# EAGLE design DB_DA7_schematic (EAGLE 9.3.2)
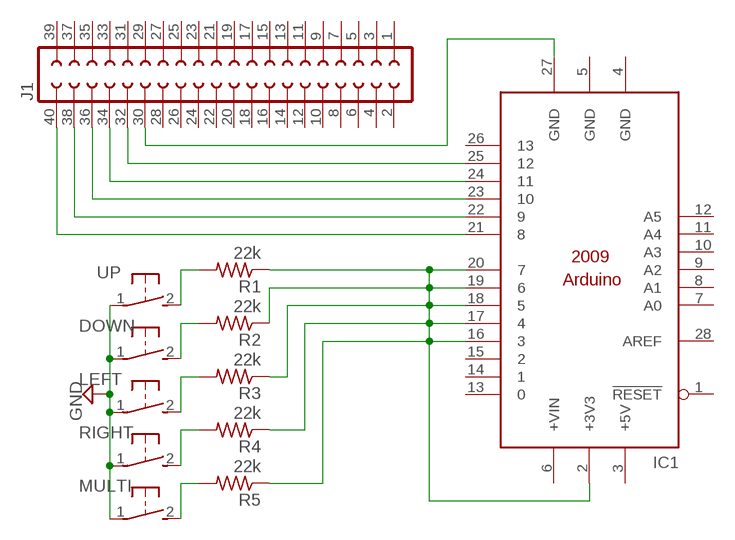
[diagram p0: schematic, sheet 1]

## Parts
DOWN  31-XX  [B3F-31XX]
IC1  ARDUINO2009_10  [ARDUINO2009]
J1  SOCKET-40V  [S40V]
LEFT  31-XX  [B3F-31XX]
MULTI  31-XX  [B3F-31XX]
R1  22k  R-US_0204/7  [0204/7]
R2  22k  R-US_0204/7  [0204/7]
R3  22k  R-US_0204/7  [0204/7]
R4  22k  R-US_0204/7  [0204/7]
R5  22k  R-US_0204/7  [0204/7]
RIGHT  31-XX  [B3F-31XX]
UP  31-XX  [B3F-31XX]

## Nets
GND: DOWN.1(P) LEFT.1(P) MULTI.1(P) RIGHT.1(P) UP.1(P)
N$1: IC1.21 J1.40
N$2: IC1.22 J1.38
N$3: IC1.23 J1.36
N$4: IC1.24 J1.34
N$5: IC1.25 J1.32
N$6: IC1.27(GND) J1.30
N$7: R1.2 UP.2(S)
N$8: DOWN.2(S) R2.2
N$9: LEFT.2(S) R3.2
N$10: R4.2 RIGHT.2(S)
N$11: MULTI.2(S) R5.2
N$16: IC1.2(+3V3) IC1.16 IC1.17 IC1.18 IC1.19 IC1.20 R1.1 R2.1 R3.1 R4.1 R5.1
Unconnected: IC1.1(!RESET) IC1.6(+VIN) IC1.7(A0) IC1.8(A1) IC1.9(A2) IC1.10(A3) IC1.11(A4) IC1.12(A5) IC1.13 IC1.14 IC1.15 IC1.26 IC1.28(AREF) J1.1 J1.2 J1.3 J1.4 J1.5 J1.6 J1.7 J1.8 J1.9 J1.10 J1.11 J1.12 J1.13 J1.14 J1.15 J1.16 J1.17 J1.18 J1.19 J1.20 J1.21 J1.22 J1.23 J1.24 J1.25 J1.26 J1.27 J1.28 J1.29 J1.31 J1.33 J1.35 J1.37 J1.39

## Power pins joined to a net without a drawn wire
+5V: IC1.3(+5V)
GND: IC1.4(GND) IC1.5(GND)

## Library data of the parts
DOWN LEFT MULTI RIGHT UP = switch-omron:31-XX: OMRON SWITCH; MPN: B3F-3100; OC_FARNELL: 959704; OC_NEWARK: 36M3582
IC1 = arduino:ARDUINO2009_1: The Arduino Duemilanove ("2009") is a microcontroller board based on the ATmega168 or ATmega328. - 14 digital input/output pins (of which 6 can be used as PWM outputs) - 6 analog inputs, a 16 MHz crystal oscillator - USB connection - power jack - ISP header - reset button It contains everything needed to support the microcontroller; simply connect it to a computer with a USB cable or power it with a AC-to-DC adapter or battery to get started http://arduino.cc/en/Main/ArduinoBoardDuemilanove
J1 = con-3m-skt-header:SOCKET-40: 40 pin PCB Socket (3m 85xx/51xx)
R1-R5 = rcl:R-US_: RESISTOR, American symbol; SPICEPREFIX: R

## Board
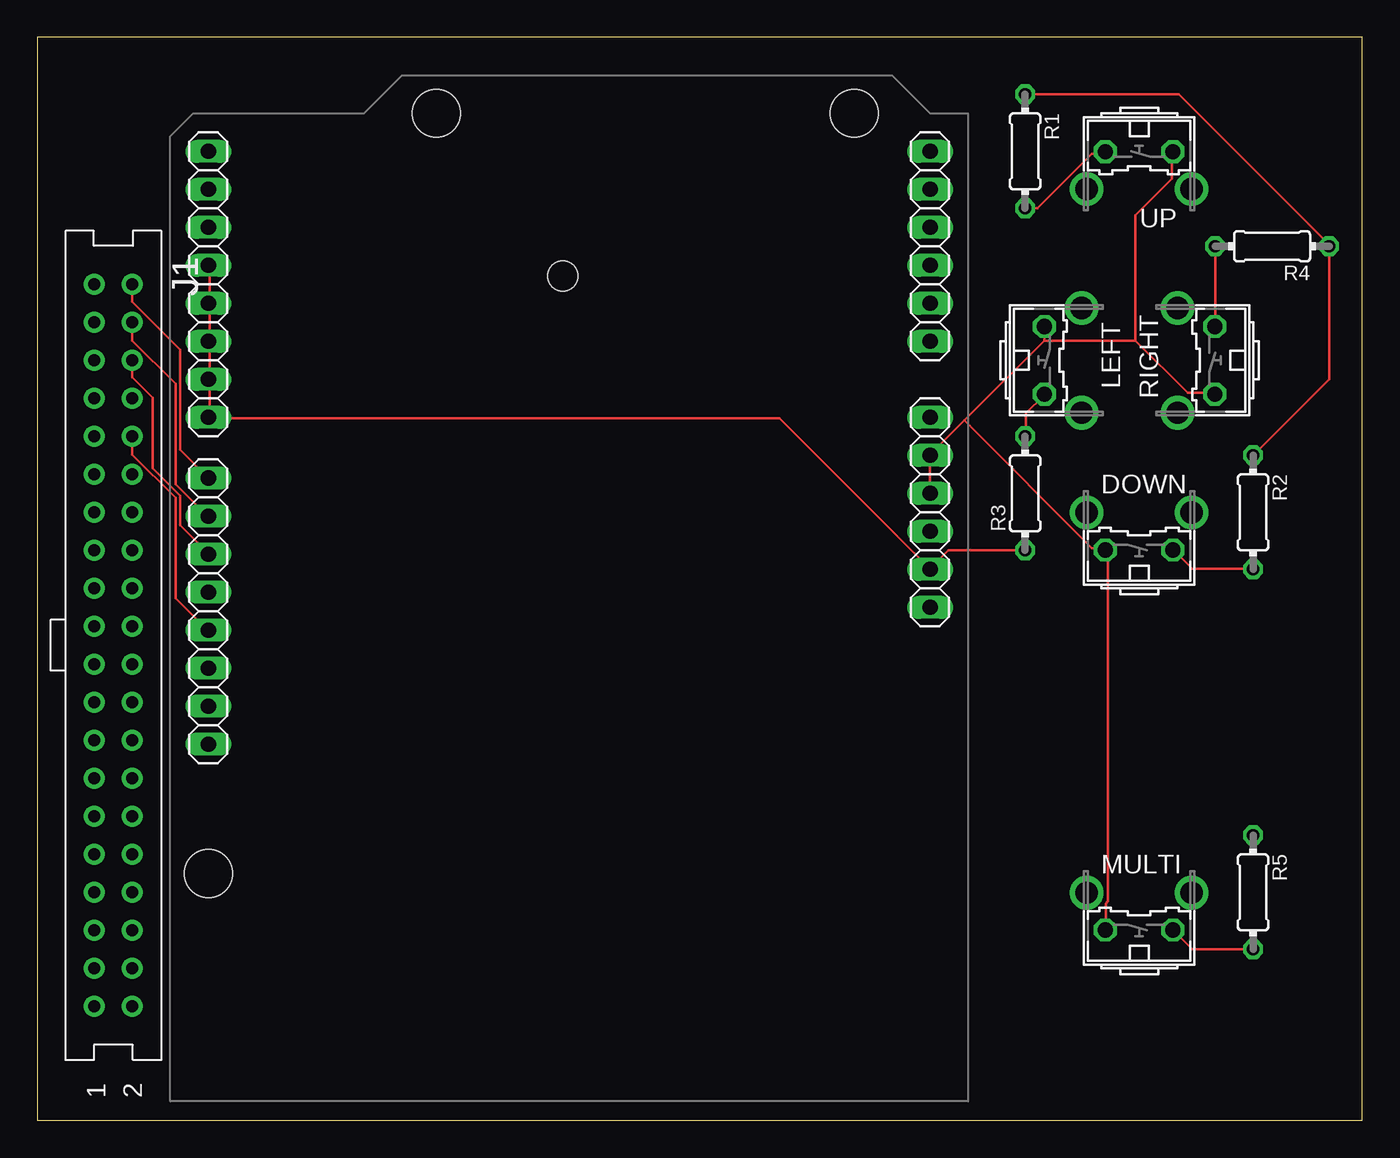
[diagram p1: board, top side]
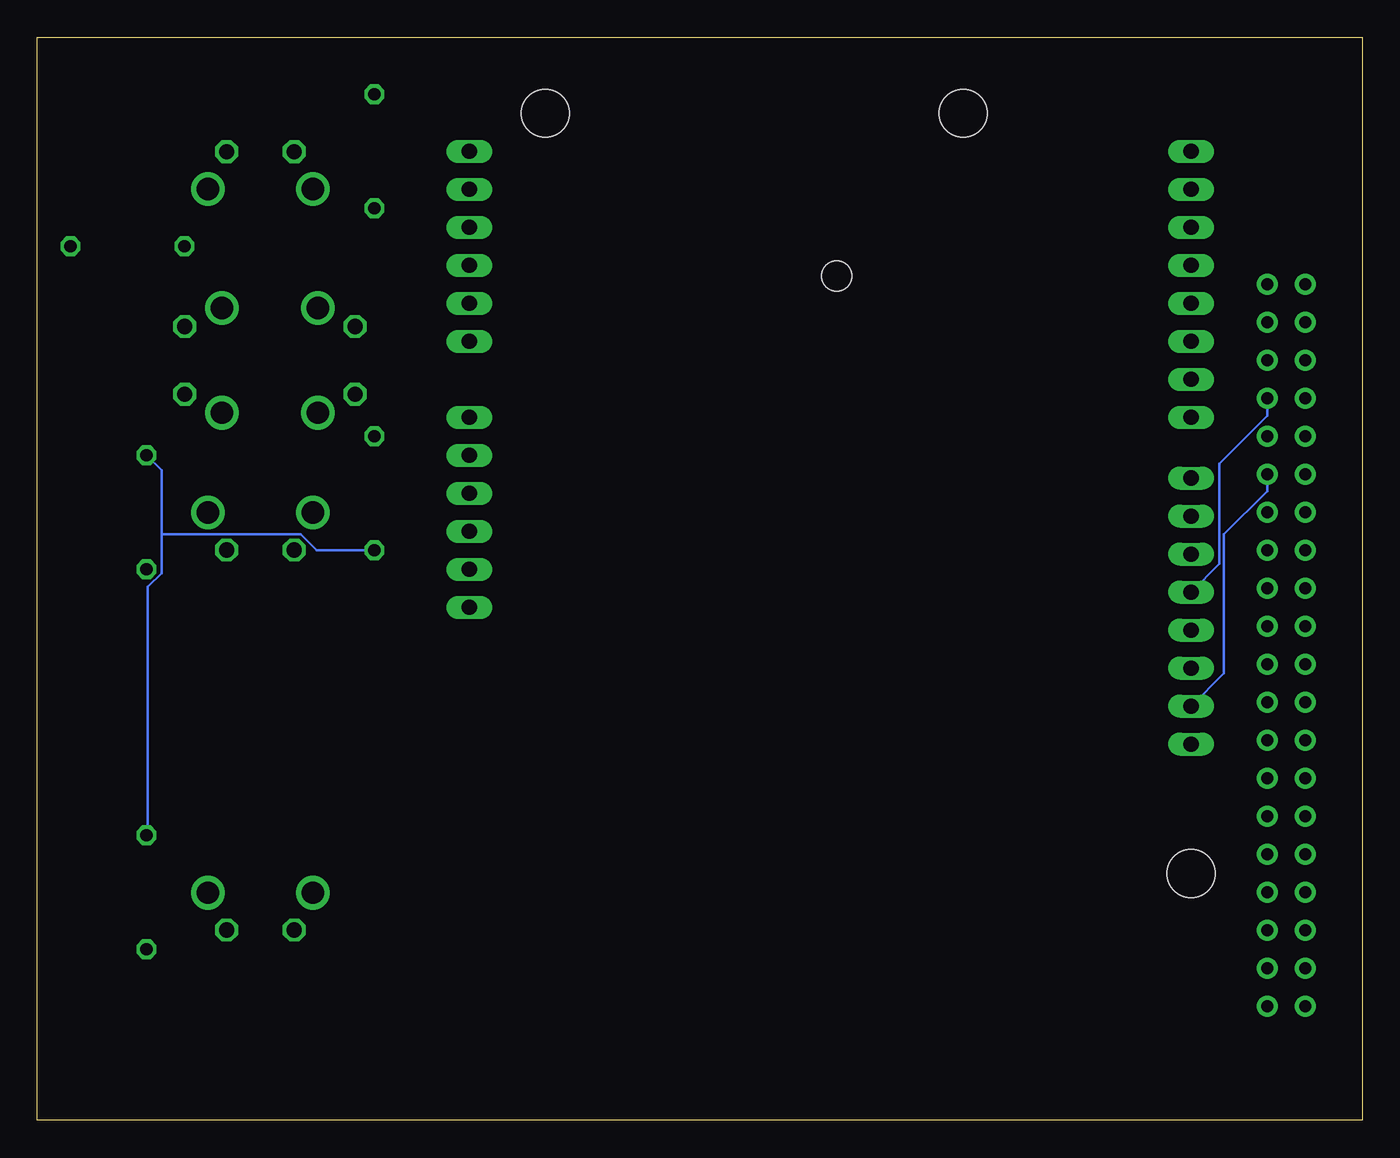
[diagram p2: board, bottom side, seen from below]

Size 88.57 x 72.38 mm. Coordinates in mm from the lower left corner, seen from the top.
Outline: 0,0 88.57,0 88.57,72.38 0,72.38 0,0
Copper layers (1*16): Top 0.035mm / dielectric 1.5mm / Bottom 0.035mm
Design rules "default": minimum track width 6mil, minimum drill 0.35mm, track to track 6mil, track to pad 6mil, pad to pad 6mil, via to via 6mil, smd to smd 6mil, copper to edge 40mil, drill to drill 6mil, minimum pad ring 10mil, minimum via ring 8mil, stop-mask expansion 4mil, vias tented up to drill 0mil, thermal gap 10mil

### Footprints (pad centres in the part's own frame; a part is rotated, then mirrored left to right if it is on the bottom)
B3F-31XX = drill 1.016 octagon: 1 -2.261,-1.245; 2 2.261,-1.245 | drill 1.499 pad 2.159: 3 -3.505,1.245; 4 3.505,1.245
ARDUINO2009 = drill 1.016 long: 1 33.02,2.54; 2 35.56,2.54; 3 38.1,2.54; 4 40.64,2.54; 5 43.18,2.54; 6 45.72,2.54; 7 50.8,2.54; 8 53.34,2.54; 9 55.88,2.54; 10 58.42,2.54; 11 60.96,2.54; 12 63.5,2.54; 13 63.5,50.8; 14 60.96,50.8; 15 58.42,50.8; 16 55.88,50.8; 17 53.34,50.8; 18 50.8,50.8; 19 48.26,50.8; 20 45.72,50.8; 21 41.656,50.8; 22 39.116,50.8; 23 36.576,50.8; 24 34.036,50.8; 25 31.496,50.8; 26 28.956,50.8; 27 26.416,50.8; 28 23.876,50.8 | hole 3.2: 15.24,50.8; 66.04,35.56; 66.04,7.62 | hole 2: 55.17,27.114
S40V = drill 0.8 pad 1.4: 1 24.13,-1.27; 2 24.13,1.27; 3 21.59,-1.27; 4 21.59,1.27; 5 19.05,-1.27; 6 19.05,1.27; 7 16.51,-1.27; 8 16.51,1.27; 9 13.97,-1.27; 10 13.97,1.27; 11 11.43,-1.27; 12 11.43,1.27; 13 8.89,-1.27; 14 8.89,1.27; 15 6.35,-1.27; 16 6.35,1.27; 17 3.81,-1.27; 18 3.81,1.27; 19 1.27,-1.27; 20 1.27,1.27; 21 -1.27,-1.27; 22 -1.27,1.27; 23 -3.81,-1.27; 24 -3.81,1.27; 25 -6.35,-1.27; 26 -6.35,1.27; 27 -8.89,-1.27; 28 -8.89,1.27; 29 -11.43,-1.27; 30 -11.43,1.27; 31 -13.97,-1.27; 32 -13.97,1.27; 33 -16.51,-1.27; 34 -16.51,1.27; 35 -19.05,-1.27; 36 -19.05,1.27; 37 -21.59,-1.27; 38 -21.59,1.27; 39 -24.13,-1.27; 40 -24.13,1.27
0204/7 = drill 0.813 octagon: 1 -3.81,0; 2 3.81,0

### Placement (x,y rotation side)
DOWN  73.66,39.37 0 top
IC1  62.23,1.27 90 top
J1  5.08,31.75 270 top
LEFT  68.58,50.8 270 top
MULTI  73.66,13.97 0 top
R1  66.04,64.77 270 top
R2  81.28,40.64 270 top
R3  66.04,41.91 90 top
R4  82.55,58.42 180 top
R5  81.28,15.24 270 top
RIGHT  77.47,50.8 90 top
UP  73.66,63.5 180 top

### Tracks (layer width: path | path; a pad name or v marks a point on that pad's centre or on a via)
GND
  Top 0.152: MULTI.1 71.42,12.8 71.42,14.48 71.58,14.63 71.58,37.95 DOWN.1 71.27,38.25 70.51,38.25 61.98,46.79 | IC1.4 IC1.5 59.69,44.5 61.98,46.79 | 67.31,52.12 67.31,53.03 LEFT.1 | 61.98,46.79 67.31,52.12 | 73.41,52.12 76.91,48.62 78.59,48.62 RIGHT.1 | 67.31,52.12 73.41,52.12 | 73.41,52.12 73.41,60.5 75.84,62.94 75.84,64.62 UP.1
N$1
  Top 0.152: J1.40 6.35,54.71 9.55,51.51 9.55,44.81 IC1.21
N$2
  Top 0.152: J1.38 6.35,52.12 9.25,49.23 9.25,42.52 11.38,40.39 IC1.22
N$3
  Top 0.152: J1.36 6.35,49.68 7.72,48.31 7.72,43.59 9.55,41.76 9.55,39.78 11.38,37.95 IC1.23
N$4
  Bottom 0.152: J1.34 6.35,47.09 9.55,43.89 9.55,37.19 IC1.24
N$5
  Top 0.152: J1.32 6.35,44.5 9.25,41.6 9.25,34.9 11.38,32.77 IC1.25
N$6
  Bottom 0.152: J1.30 6.35,42.06 9.25,39.17 9.25,29.87 IC1.27
N$7
  Top 0.152: R1.2 66.85,60.96 70.51,64.62 71.27,64.62 UP.2
N$8
  Top 0.152: R2.2 81.18,36.88 77.22,36.88 76,38.1 DOWN.2
N$9
  Top 0.152: R3.2 66.09,45.72 66.09,47.24 67.31,48.46 LEFT.2
N$10
  Top 0.152: R4.2 78.74,53.19 RIGHT.2
N$11
  Top 0.152: R5.2 77.22,11.43 MULTI.2
N$16
  Top 0.152: 11.53,49.53 11.53,47.09 IC1.20 11.53,46.94 49.63,46.94 59.69,36.88 | IC1.16 11.53,57.15 11.53,54.71 IC1.17 11.53,54.56 11.53,52.12 IC1.18 11.53,51.97 11.53,49.53 | 11.53,49.53 IC1.19 | R3.1 60.91,38.1 59.69,36.88 | R2.1 86.36,49.53 R4.1 86.36,58.52 76.3,68.58 R1.1 | 59.69,36.88 IC1.2
  Bottom 0.152: 80.26,39.17 80.26,43.43 R2.1 | 80.26,39.17 80.26,36.58 81.18,35.66 81.18,19.05 R5.1 | R3.1 69.9,38.1 70.97,39.17 80.26,39.17